# Altium schematic sheet SHEET1.SCHDOC
size 292 x 215 mm
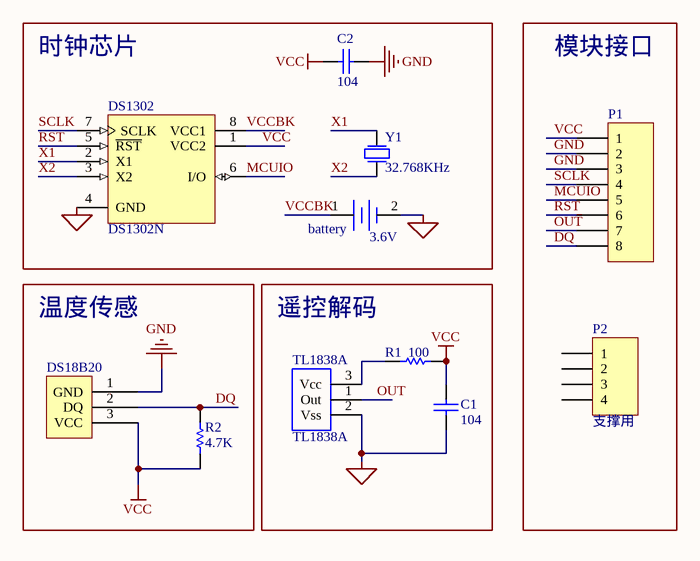
[diagram p0: SHEET1.SCHDOC]

## Parts
battery  3.6V  [POW1_HT]
C1  CAP  [CAP2A_DQ]  (value not drawn)
C2  CAP  [CAP2A_DQ]  (value not drawn)
DS18B20  DALLAS IC  [TO92C]  (value not drawn)
DS1302  DS1302N  [DIP8]
P1  Header 8  [HDR1X8]  (value not drawn)
P2  支撑用  [HDR1X4]
R1  Resister  [AXIAL-0.3]  (value not drawn)
R2  Resister  [AXIAL-0.3]  (value not drawn)
TL1838A  TL1838A  [DIP3_HT]
Y1  32.768KHz  [BCY-W2/D3.1]

## Blocks framed on the sheet
时钟芯片: battery C2 DS1302 Y1
模块接口: P1 P2
温度传感: DS18B20 R2
遥控解码: C1 R1 TL1838A

## Nets
GND: battery.2(-) C1.2 C2.2 DS18B20.1(GND) DS1302.4(GND) P1.2 P1.3 TL1838A.2(Vss)
VCC: C1.1 C2.1 DS18B20.3(VCC) DS1302.1(VCC2) P1.1 R1.1 R2.2
DQ: DS18B20.2(DQ) P1.8 R2.1
MCUIO: DS1302.6(I/O) P1.5
OUT: P1.7 TL1838A.1(Out)
RST: DS1302.5(~{RST}) P1.6
SCLK: DS1302.7(SCLK) P1.4
VCCBK: battery.1(+) DS1302.8(VCC1)
X1: DS1302.2(X1) Y1.1(P1)
X2: DS1302.3(X2) Y1.2(P2)
NetR1_2: R1.2 TL1838A.3(Vcc)

Not connected (* = marked no-connect by the designer): P2 1 2 3 4

## Notes on the sheet
- (in symbol CAP0805) 104
- (in symbol Resister) 100; 4.7K

## Library data of the parts
battery = BATTERY
C1 C2 = CAP0805: CAP with C0805 footprint
DS18B20 = DS18B20
DS1302 = DS1302N: Trickle Charge Timekeeping Chip; PackageDocument: 1999; Published: 13-Oct-2000; LatestRevisionDate: 4-Mar-2005; LatestRevisionNote: Stylized 3D Model Added.; DatasheetDocument: 2-Jul-1999; PackageReference: DIP8; Publisher: Altium Limited; ComponentLink1Description: Manufacturer Link; ComponentLink1URL: http://www.maxim-ic.com/
P1 = Header 8: Header, 8-Pin; LatestRevisionDate: 17-Jul-2002; LatestRevisionNote: Re-released for DXP Platform.; Publisher: Altium Limited
P2 = Header 4: 支撑作用; LatestRevisionDate: 17-Jul-2002; LatestRevisionNote: Re-released for DXP Platform.; Publisher: Altium Limited
R1 R2 = Resister: Resister with c0805 footprint
Y1 = 12MHZ: Crystal Oscillator